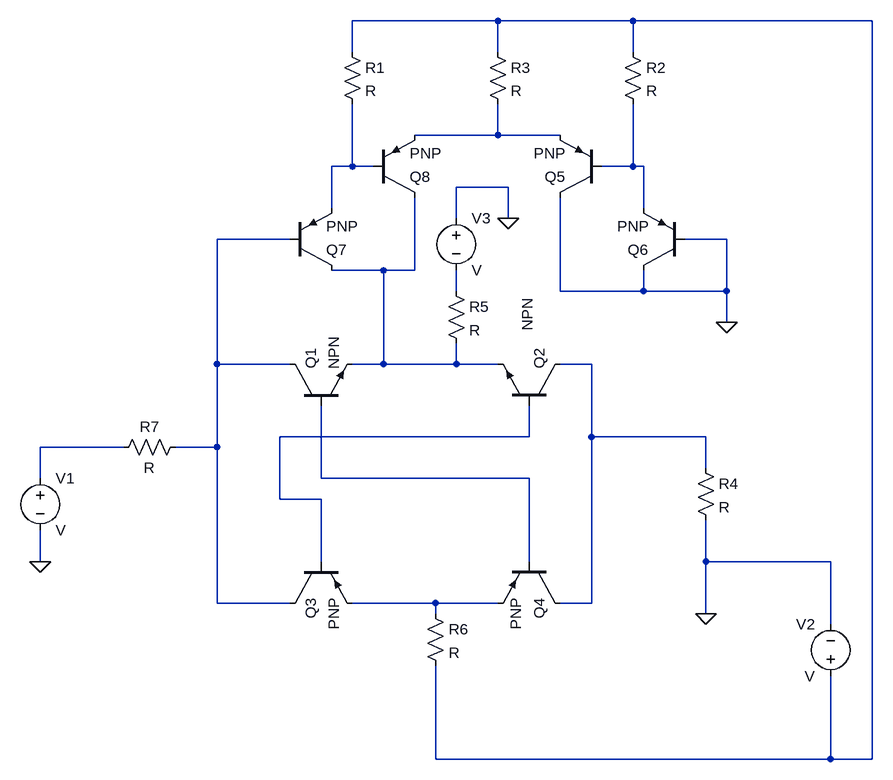
[diagram p0: schematic BMvca.asc]
BMvca.asc, the LTspice schematic file:
Version 4
SHEET 1 1004 736
WIRE 400 -864 176 -864
WIRE 608 -864 400 -864
WIRE 976 -864 608 -864
WIRE 176 -816 176 -864
WIRE 400 -816 400 -864
WIRE 608 -816 608 -864
WIRE 400 -688 400 -736
WIRE 400 -688 272 -688
WIRE 496 -688 400 -688
WIRE 176 -640 176 -736
WIRE 176 -640 144 -640
WIRE 208 -640 176 -640
WIRE 608 -640 608 -736
WIRE 608 -640 560 -640
WIRE 624 -640 608 -640
WIRE 416 -608 336 -608
WIRE 144 -576 144 -640
WIRE 624 -576 624 -640
WIRE 336 -560 336 -608
WIRE 416 -560 416 -608
WIRE 80 -528 -32 -528
WIRE 752 -528 688 -528
WIRE 224 -480 144 -480
WIRE 272 -480 272 -592
WIRE 272 -480 224 -480
WIRE 336 -448 336 -480
WIRE 496 -448 496 -592
WIRE 624 -448 624 -480
WIRE 624 -448 496 -448
WIRE 752 -448 752 -528
WIRE 752 -448 624 -448
WIRE 752 -400 752 -448
WIRE -32 -336 -32 -528
WIRE 80 -336 -32 -336
WIRE 224 -336 224 -480
WIRE 224 -336 176 -336
WIRE 336 -336 336 -368
WIRE 336 -336 224 -336
WIRE 400 -336 336 -336
WIRE 544 -336 496 -336
WIRE 448 -224 448 -272
WIRE 448 -224 64 -224
WIRE 544 -224 544 -336
WIRE 720 -224 544 -224
WIRE -176 -208 -304 -208
WIRE -32 -208 -32 -336
WIRE -32 -208 -96 -208
WIRE 720 -176 720 -224
WIRE -304 -160 -304 -208
WIRE 128 -160 128 -272
WIRE 448 -160 128 -160
WIRE 64 -128 64 -224
WIRE 128 -128 64 -128
WIRE -304 -32 -304 -80
WIRE 128 -32 128 -128
WIRE 448 -32 448 -160
WIRE 720 -32 720 -96
WIRE 912 -32 720 -32
WIRE -32 32 -32 -208
WIRE 80 32 -32 32
WIRE 304 32 176 32
WIRE 400 32 304 32
WIRE 544 32 544 -224
WIRE 544 32 496 32
WIRE 304 48 304 32
WIRE 720 48 720 -32
WIRE 912 64 912 -32
WIRE 304 272 304 128
WIRE 912 272 912 144
WIRE 912 272 304 272
WIRE 976 272 976 -864
WIRE 976 272 912 272
FLAG 752 -400 0
FLAG 416 -560 0
FLAG -304 -32 0
FLAG 720 48 0
SYMBOL npn 80 -272 R270
SYMATTR InstName Q1
SYMBOL npn 496 -272 M270
WINDOW 3 115 51 Left 2
SYMATTR InstName Q2
SYMBOL pnp 80 -32 M90
SYMATTR InstName Q3
SYMBOL pnp 496 -32 R90
SYMATTR InstName Q4
SYMBOL pnp 560 -592 R180
SYMATTR InstName Q5
SYMBOL pnp 688 -480 R180
SYMATTR InstName Q6
SYMBOL pnp 80 -480 M180
SYMATTR InstName Q7
SYMBOL pnp 208 -592 M180
SYMATTR InstName Q8
SYMBOL res 160 -832 R0
SYMATTR InstName R1
SYMBOL res 592 -832 R0
SYMATTR InstName R2
SYMBOL res 384 -832 R0
SYMATTR InstName R3
SYMBOL res 704 -192 R0
SYMATTR InstName R4
SYMBOL res 320 -464 R0
SYMATTR InstName R5
SYMBOL res 288 32 R0
SYMATTR InstName R6
SYMBOL res -80 -224 R90
WINDOW 0 0 56 VBottom 2
WINDOW 3 32 56 VTop 2
SYMATTR InstName R7
SYMBOL voltage -304 -176 R0
SYMATTR InstName V1
SYMBOL voltage 912 160 R180
WINDOW 0 24 96 Left 2
WINDOW 3 24 16 Left 2
SYMATTR InstName V2
SYMBOL voltage 336 -576 R0
SYMATTR InstName V3

The netlist it stands for:
* BMvca.asc
Q1 N005 N011 N006 0 NPN
Q2 N008 N009 N006 0 NPN
Q3 N005 N009 N012 0 PNP
Q4 N008 N011 N012 0 PNP
Q5 0 N004 N002 0 PNP
Q6 0 0 N004 0 PNP
Q7 N006 N005 N003 0 PNP
Q8 N006 N003 N002 0 PNP
R1 N001 N003 R
R2 N001 N004 R
R3 N001 N002 R
R4 N008 0 R
R5 N007 N006 R
R6 N012 N001 R
R7 N005 N010 R
V1 N010 0 V
V2 N001 0 V
V3 0 N007 V
.model NPN NPN
.model PNP PNP
.lib standard.bjt
.backanno
.end